# Altium schematic sheet psu.schdoc
size A4
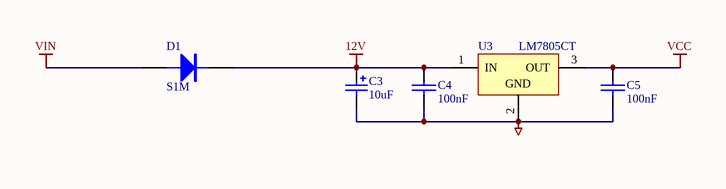
[diagram p0: psu.schdoc]

## Parts
C3  10uF  [TAG B CASE]
C4  100nF  [CAP (3D) - 0603]
C5  100nF  [CAP (3D) - 0603]
D1  S1M  [DO-214AC]
U3  LM7805CT  [TO-220]

## Nets
12V: C3.1 C4.1 D1.2(K) U3.1(IN)
GND: C3.2 C4.2 C5.2 U3.2(GND)
VCC: C5.1 U3.3(OUT)
VIN: D1.1(A)

## Library data of the parts
C3 = Cap Pol: CAPACITOR POLARISED TAG B CASE; Manufacturer: Vishay/Sprague; Manufacturer Part No.: 591D106X9020B2T15H; value: 10uF; Mouser Part no.: 71-591D106X9020B2T15; Web link: http://au.mouser.com/ProductDetail/Vishay-Sprague/591D106X9020B2T15H/?qs=sGAEpiMZZMuEN2agSAc2pvHIaWFtjSV0lDKOXo3DDxQ%3d
C4 C5 = CAP: CAPACITOR SMD 0603; Manufacturer: Murata; Manufacturer Part No.: GCM188R71C104KA37D; value: 100nF; Mouser Part no.: 81-GCM188R71C104KA7D; Web link: http://au.mouser.com/ProductDetail/Murata/GCM188R71C104KA37D/?qs=aEuGZpxfbxWKAxwYn%252beTMg%3d%3d
D1 = DIODE: DIODE, POWER; Manufacturer: TAIWAN SEMI; Mouser Part no.: 821-S1M; Manufacturer Part No.: S1M; value: S1M; Web link: http://au.mouser.com/ProductDetail/Taiwan-Semiconductor/S1M/?qs=sGAEpiMZZMtEwUVCuofpuOlSmRjzJonf%252bmrIm0%252bGbjE%3d
U3 = MC7805ACT: 3-Terminal Positive Fixed Voltage Regulator; Manufacturer: Fairchild Semiconductor; Mouser Part No.: 512-LM7805CT; Value: LM7805CT; Manufacturer Part No.: LM7805CT; Web link: http://au.mouser.com/ProductDetail/Fairchild-Semiconductor/LM7805CT/?qs=sGAEpiMZZMtUqDgmOWBjgPJMQlYvsHAW%252bBbwCYnQla0%3d